# EAGLE design exp21ac (EAGLE 7.7.0)
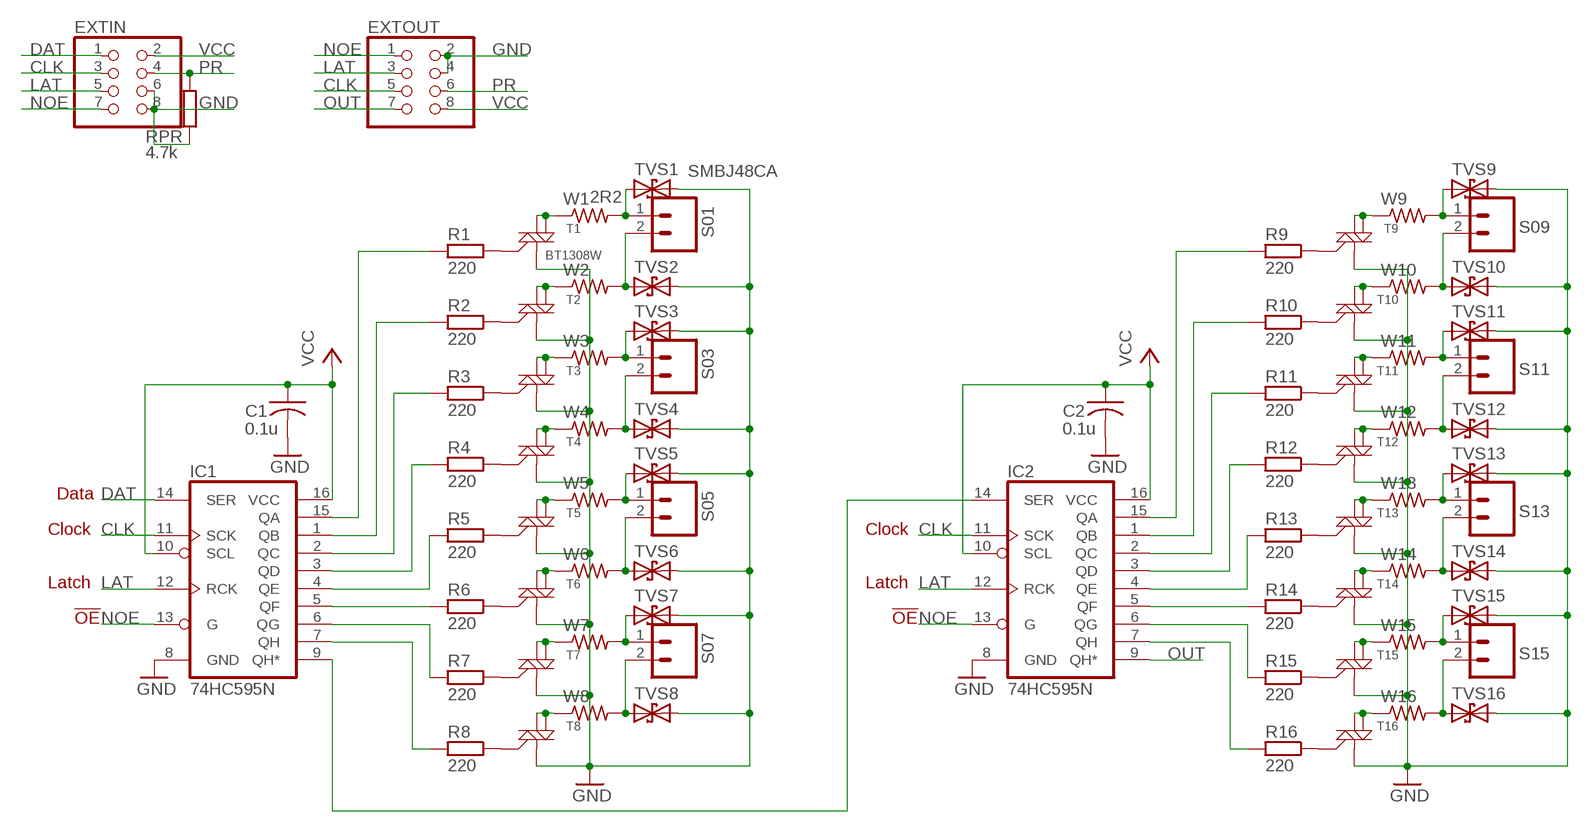
[diagram p0: schematic, sheet 1]

## Parts
C1  0.1u  C-USC0603K  [C0603K]
C2  0.1u  C-USC0603K  [C0603K]
EXTIN  PINHD-2X4/90  [2X04/90]
EXTOUT  PINHD-2X4/90  [2X04/90]
IC1  74HC595N  74LS595D  [SO16]
IC2  74HC595N  74LS595D  [SO16]
R1  220  R-EU_R0603  [R0603]
R2  220  R-EU_R0603  [R0603]
R3  220  R-EU_R0603  [R0603]
R4  220  R-EU_R0603  [R0603]
R5  220  R-EU_R0603  [R0603]
R6  220  R-EU_R0603  [R0603]
R7  220  R-EU_R0603  [R0603]
R8  220  R-EU_R0603  [R0603]
R9  220  R-EU_R0603  [R0603]
R10  220  R-EU_R0603  [R0603]
R11  220  R-EU_R0603  [R0603]
R12  220  R-EU_R0603  [R0603]
R13  220  R-EU_R0603  [R0603]
R14  220  R-EU_R0603  [R0603]
R15  220  R-EU_R0603  [R0603]
R16  220  R-EU_R0603  [R0603]
RPR  4.7k  R-EU_R0603  [R0603]
S01  M025MM-X  [SCREWTERMINAL-5MM-2-X]
S03  M025MM-X  [SCREWTERMINAL-5MM-2-X]
S05  M025MM-X  [SCREWTERMINAL-5MM-2-X]
S07  M025MM-X  [SCREWTERMINAL-5MM-2-X]
S09  M025MM-X  [SCREWTERMINAL-5MM-2-X]
S11  M025MM-X  [SCREWTERMINAL-5MM-2-X]
S13  M025MM-X  [SCREWTERMINAL-5MM-2-X]
S15  M025MM-X  [SCREWTERMINAL-5MM-2-X]
T1  BT1308W  MAC97SOT223  [SOT223]
T2  MAC97SOT223  [SOT223]
T3  MAC97SOT223  [SOT223]
T4  MAC97SOT223  [SOT223]
T5  MAC97SOT223  [SOT223]
T6  MAC97SOT223  [SOT223]
T7  MAC97SOT223  [SOT223]
T8  MAC97SOT223  [SOT223]
T9  MAC97  MAC97SOT223  [SOT223]
T10  MAC97  MAC97SOT223  [SOT223]
T11  MAC97  MAC97SOT223  [SOT223]
T12  MAC97  MAC97SOT223  [SOT223]
T13  MAC97  MAC97SOT223  [SOT223]
T14  MAC97  MAC97SOT223  [SOT223]
T15  MAC97  MAC97SOT223  [SOT223]
T16  MAC97  MAC97SOT223  [SOT223]
TVS1  SMBJ48CA  TVSSMB  [SMB]
TVS2  TVSSMB  [SMB]
TVS3  TVSSMB  [SMB]
TVS4  TVSSMB  [SMB]
TVS5  TVSSMB  [SMB]
TVS6  TVSSMB  [SMB]
TVS7  TVSSMB  [SMB]
TVS8  TVSSMB  [SMB]
TVS9  TVSSMB  [SMB]
TVS10  TVSSMB  [SMB]
TVS11  TVSSMB  [SMB]
TVS12  TVSSMB  [SMB]
TVS13  TVSSMB  [SMB]
TVS14  TVSSMB  [SMB]
TVS15  TVSSMB  [SMB]
TVS16  TVSSMB  [SMB]
W1  2R2  R-US_R2512  [R2512]
W2  R-US_R2512  [R2512]
W3  R-US_R2512  [R2512]
W4  R-US_R2512  [R2512]
W5  R-US_R2512  [R2512]
W6  R-US_R2512  [R2512]
W7  R-US_R2512  [R2512]
W8  R-US_R2512  [R2512]
W9  R-US_R2512  [R2512]
W10  R-US_R2512  [R2512]
W11  R-US_R2512  [R2512]
W12  R-US_R2512  [R2512]
W13  R-US_R2512  [R2512]
W14  R-US_R2512  [R2512]
W15  R-US_R2512  [R2512]
W16  R-US_R2512  [R2512]

## Nets
CLK: EXTIN.3 EXTOUT.5 IC1.11(SCK) IC2.11(SCK)
DAT: EXTIN.1 IC1.14(SER)
GND [power]: C1.2 C2.2 EXTIN.6 EXTIN.8 EXTOUT.2 EXTOUT.4 IC1.8(GND) IC2.8(GND) RPR.1 T1.1(M1) T2.1(M1) T3.1(M1) T4.1(M1) T5.1(M1) T6.1(M1) T7.1(M1) T8.1(M1) T9.1(M1) T10.1(M1) T11.1(M1) T12.1(M1) T13.1(M1) T14.1(M1) T15.1(M1) T16.1(M1) TVS1.C TVS2.C TVS3.C TVS4.C TVS5.C TVS6.C TVS7.C TVS8.C TVS9.C TVS10.C TVS11.C TVS12.C TVS13.C TVS14.C TVS15.C TVS16.C
LAT: EXTIN.5 EXTOUT.3 IC1.12(RCK) IC2.12(RCK)
N$1 [power]: S01.1 TVS1.A W1.2
N$2 [power]: S03.1 TVS3.A W3.2
N$3 [power]: S05.1 TVS5.A W5.2
N$4: IC1.5(QF) R6.2
N$5: IC1.6(QG) R7.2
N$6 [power]: S07.1 TVS7.A W7.2
N$7: IC1.7(QH) R8.2
N$8: R1.1 T1.3(G)
N$9: R2.1 T2.3(G)
N$10: IC1.4(QE) R5.2
N$11: IC1.3(QD) R4.2
N$12: IC1.2(QC) R3.2
N$13: IC1.1(QB) R2.2
N$14: IC1.15(QA) R1.2
N$15: R3.1 T3.3(G)
N$16: R4.1 T4.3(G)
N$17 [power]: S01.2 TVS2.A W2.2
N$18: R5.1 T5.3(G)
N$19: R6.1 T6.3(G)
N$20 [power]: S03.2 TVS4.A W4.2
N$21: R7.1 T7.3(G)
N$22: R8.1 T8.3(G)
N$23 [power]: S05.2 TVS6.A W6.2
N$24: IC2.5(QF) R14.2
N$25 [power]: S07.2 TVS8.A W8.2
N$26: IC2.6(QG) R15.2
N$27: IC2.7(QH) R16.2
N$28: IC2.4(QE) R13.2
N$29: IC2.3(QD) R12.2
N$30: IC2.2(QC) R11.2
N$31: IC2.1(QB) R10.2
N$32: IC2.15(QA) R9.2
N$33 [power]: S09.2 TVS10.A W10.2
N$34 [power]: S11.2 TVS12.A W12.2
N$35 [power]: S13.2 TVS14.A W14.2
N$36 [power]: S15.2 TVS16.A W16.2
N$37 [power]: S09.1 TVS9.A W9.2
N$38: S11.1 TVS11.A W11.2
N$39: S13.1 TVS13.A W13.2
N$40: S15.1 TVS15.A W15.2
N$41: R9.1 T9.3(G)
N$42: R10.1 T10.3(G)
N$43: R11.1 T11.3(G)
N$44: R12.1 T12.3(G)
N$45: R13.1 T13.3(G)
N$46: R14.1 T14.3(G)
N$47: R15.1 T15.3(G)
N$48: R16.1 T16.3(G)
N$49: IC1.9(QH*) IC2.14(SER)
N$50 [power]: T1.2(M2) T1.4(M2-4) W1.1
N$51 [power]: T2.2(M2) T2.4(M2-4) W2.1
N$52 [power]: T3.2(M2) T3.4(M2-4) W3.1
N$53 [power]: T4.2(M2) T4.4(M2-4) W4.1
N$54 [power]: T5.2(M2) T5.4(M2-4) W5.1
N$55 [power]: T6.2(M2) T6.4(M2-4) W6.1
N$56 [power]: T7.2(M2) T7.4(M2-4) W7.1
N$57 [power]: T8.2(M2) T8.4(M2-4) W8.1
N$58 [power]: T9.2(M2) T9.4(M2-4) W9.1
N$59 [power]: T10.2(M2) T10.4(M2-4) W10.1
N$60: T11.2(M2) T11.4(M2-4) W11.1
N$61 [power]: T12.2(M2) T12.4(M2-4) W12.1
N$62: T13.2(M2) T13.4(M2-4) W13.1
N$63 [power]: T14.2(M2) T14.4(M2-4) W14.1
N$64: T15.2(M2) T15.4(M2-4) W15.1
N$65 [power]: T16.2(M2) T16.4(M2-4) W16.1
NOE: EXTIN.7 EXTOUT.1 IC1.13(G) IC2.13(G)
OUT: EXTOUT.7 IC2.9(QH*)
PR: EXTIN.4 EXTOUT.6 RPR.2
VCC: C1.1 C2.1 EXTIN.2 EXTOUT.8 IC1.10(SCL) IC1.16(VCC) IC2.10(SCL) IC2.16(VCC)

## Notes on the sheet
- Data
- Clock | Clock
- Latch | Latch
- !OE | !OE

## Library data of the parts
C1 C2 = adafruit2013:C-US: CAPACITOR, American symbol
EXTIN EXTOUT = pinhead:PINHD-2X4: PIN HEADER
IC1 IC2 = SparkFun:74*595: 8-bit SHIFT REGISTER, output latch
R1-R16 RPR = rcl:R-EU_: RESISTOR, European symbol
S01 S03 S05 S07 S09 S11 S13 S15 = SparkFun:M02: Header 2 Standard 2-pin 0.1" header. Use with straight break away headers (SKU : PRT-00116), right angle break away headers (PRT-00553), swiss pins (PRT-00743), machine pins (PRT-00117), and female headers (PRT-00115). Molex polarized connector foot print use with SKU : PRT-08233 with associated crimp pins and housings.
T1-T16 = SparkFun:MAC97: MAC97 Triac http://www.onsemi.com/pub_link/Collateral/MAC97-D.PDF
TVS1-TVS16 = SparkFunNew:TVS
W1-W16 = resistor:R-US_: RESISTOR, American symbol

## Net classes
0 default: width 0.254 mm, clearance 0.203 mm
1 power: width 0.508 mm, clearance 0.203 mm

## Board
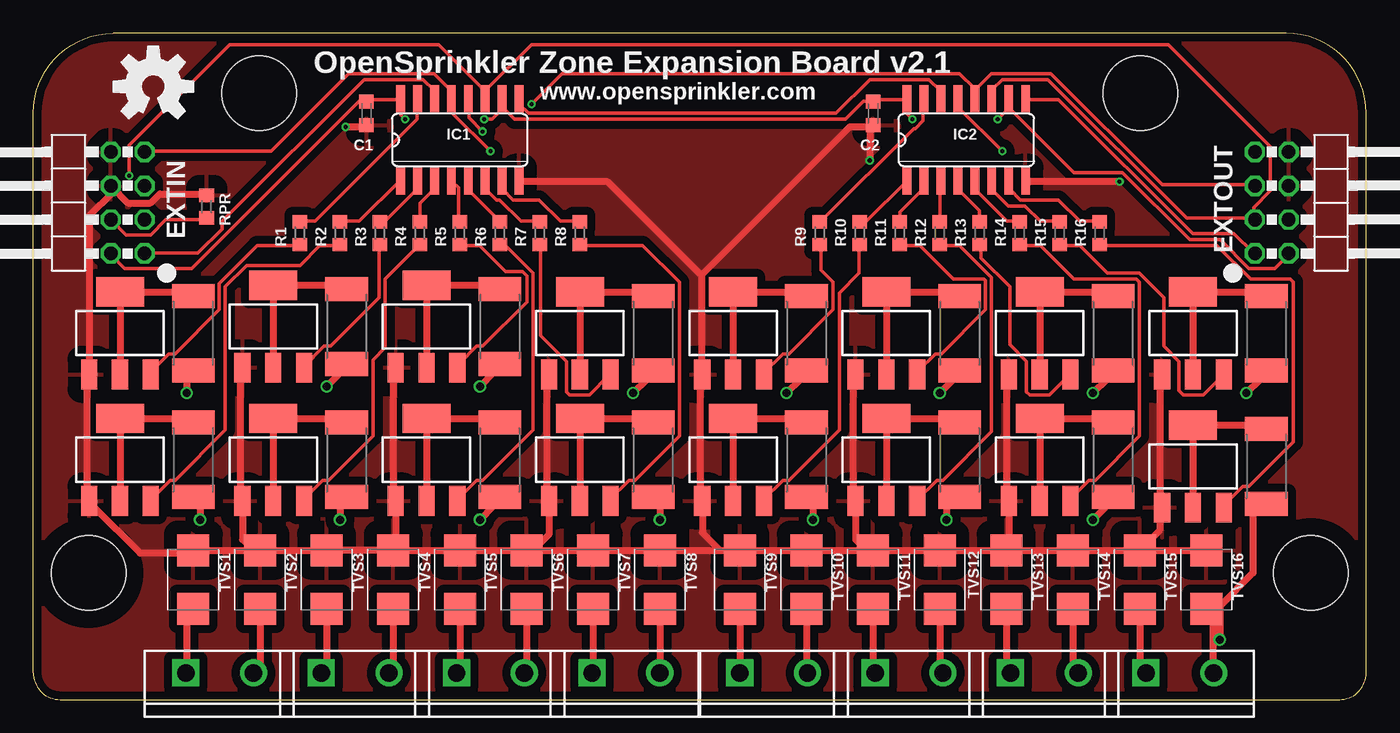
[diagram p1: board, top side]
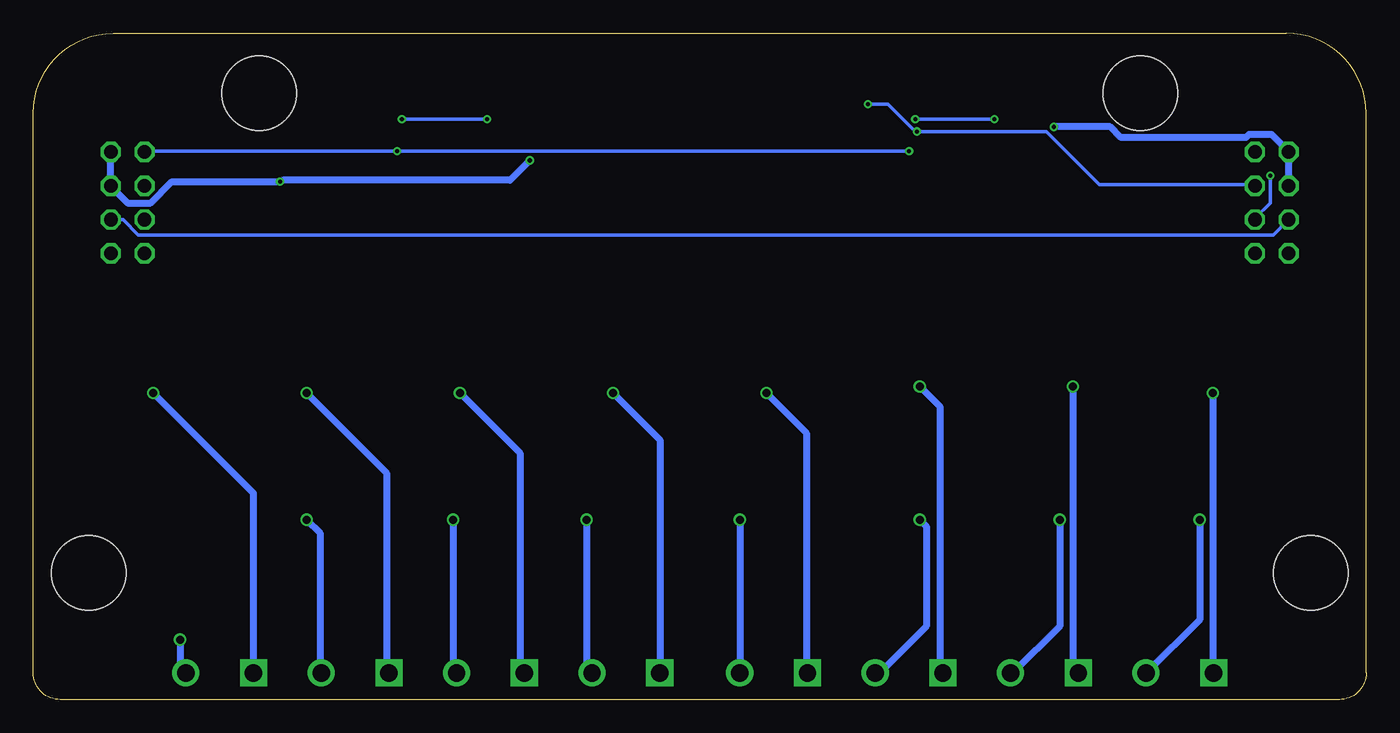
[diagram p2: board, bottom side, seen from below]

Size 100 x 50 mm. Coordinates in mm from the lower left corner, seen from the top.
Outline: 2,0 98,0 arc90 100,2 100,44 arc90 94,50 6,50 arc90 0,44 0,2 arc90 2,0
Copper layers (1*16): Top 0.035mm / dielectric 1.5mm / Bottom 0.035mm
Design rules "Fusion_eagle_rule_v1.1 *": minimum track width 6mil, minimum drill 12mil, track to track 6mil, track to pad 6mil, pad to pad 6mil, via to via 6mil, smd to smd 0mil, copper to edge 10mil, drill to drill 10mil, minimum pad ring 10mil, minimum via ring 6mil, stop-mask expansion 2mil, vias tented up to drill 100mil, thermal gap 40mil
Holes 5.6 mm at 4.14,9.49 95.86,9.49 16.95,45.49 83.06,45.49
tRestrict: area 0.6,6 to 7.6,13; area 92.4,6 to 99.4,13; area 13.4,42 to 20.4,49; area 79.6,42 to 86.6,49
vRestrict: area 21,45 to 78,49

### Footprints (pad centres in the part's own frame; a part is rotated, then mirrored left to right if it is on the bottom)
C0603K = smd 1.05 x 1.08: 1 -0.875,0; 2 0.875,0
2X04/90 = drill 1.016 octagon: 1 -3.81,-6.35; 2 -3.81,-3.81; 3 -1.27,-6.35; 4 -1.27,-3.81; 5 1.27,-6.35; 6 1.27,-3.81; 7 3.81,-6.35; 8 3.81,-3.81
SO16 = smd 0.66 x 2.032: 1 -4.445,-3.073; 2 -3.175,-3.073; 3 -1.905,-3.073; 4 -0.635,-3.073; 5 0.635,-3.073; 6 1.905,-3.073; 7 3.175,-3.073; 8 4.445,-3.073; 9 4.445,3.073; 10 3.175,3.073; 11 1.905,3.073; 12 0.635,3.073; 13 -0.635,3.073; 14 -1.905,3.073; 15 -3.175,3.073; 16 -4.445,3.073
R0603 = smd 1 x 1.1: 1 -0.85,0; 2 0.85,0
SCREWTERMINAL-5MM-2-X = drill 1.3 pad 2.032 square: 1 0,0 | drill 1.3 pad 2.032: 2 5.08,0
SOT223 = smd 1.219 x 2.235: 1 -2.311,-3.099; 2 0,-3.099; 3 2.311,-3.099 | smd 3.6 x 2.2: 4 0,3.099
SMB = smd 2.4 x 2.4: A 2.2,0; C -2.2,0
R2512 = smd 1.8 x 3.2: 1 -2.8,0; 2 2.8,0

### Placement (x,y rotation side)
C1  25,44 270 top
C2  63,44 270 top
EXTIN  2,37.29 90 top
EXTOUT  98,37.29 270 top
IC1  32,42 0 top
IC2  70,42 0 top
R1  20,35 90 top
R2  23,35 90 top
R3  26,35 90 top
R4  29,35 90 top
R5  32,35 90 top
R6  35,35 90 top
R7  38,35 90 top
R8  41,35 90 top
R9  59,35 90 top
R10  62,35 90 top
R11  65,35 90 top
R12  68,35 90 top
R13  71,35 90 top
R14  74,35 90 top
R15  77,35 90 top
R16  80,35 90 top
RPR  13,37 270 top
S01  11.44,2 0 top
S03  21.6,2 0 top
S05  31.76,2 0 top
S07  41.92,2 0 top
S09  53,2 0 top
S11  63.16,2 0 top
S13  73.32,2 0 top
S15  83.48,2 0 top
T1  6.5,27.5 0 top
T2  6.5,18 0 top
T3  18,28 0 top
T4  18,18 0 top
T5  29.5,28 0 top
T6  29.5,18 0 top
T7  41,27.5 0 top
T8  41,18 0 top
T9  52.5,27.5 0 top
T10  52.5,18 0 top
T11  64,27.5 0 top
T12  64,18 0 top
T13  75.5,27.5 0 top
T14  75.5,18 0 top
T15  87,27.5 0 top
T16  87,17.5 0 top
TVS1  12,9 270 top
TVS2  17,9 270 top
TVS3  22,9 270 top
TVS4  27,9 270 top
TVS5  32,9 270 top
TVS6  37,9 270 top
TVS7  42,9 270 top
TVS8  47,9 270 top
TVS9  53,9 270 top
TVS10  58,9 270 top
TVS11  63,9 270 top
TVS12  68,9 270 top
TVS13  73,9 270 top
TVS14  78,9 270 top
TVS15  83,9 270 top
TVS16  88,9 270 top
W1  12,27.5 270 top
W2  12,18 270 top
W3  23.5,28 270 top
W4  23.5,18 270 top
W5  35,28 270 top
W6  35,18 270 top
W7  46.5,27.5 270 top
W8  46.5,18 270 top
W9  58,27.5 270 top
W10  58,18 270 top
W11  69.5,27.5 270 top
W12  69.5,18 270 top
W13  81,27.5 270 top
W14  81,18 270 top
W15  92.5,27.5 270 top
W16  92.5,17.5 270 top

### Tracks (layer width: path | path; a pad name or v marks a point on that pad's centre or on a via)
CLK  (via drill 0.3)
  Top 0.254: IC2.11 72.01,45.15 72.01,45.83 72.69,46.52 76.12,46.52 86.53,36.12 91.55,36.12 EXTOUT.5 91.55,36.23 91.55,36.92 92.81,38.18 92.81,41.49 85.15,49.15 37.38,49.15 33.95,45.72 IC1.11 33.83,45.15 33.83,45.72 30.4,49.15 14.74,49.15 7.2,41.6 v7.2,39.32
  Bottom 0.254: v7.2,39.32 7.2,37.26 8.34,36.12 EXTIN.3
DAT
  Top 0.254: IC1.14 30.06,45.15 30.06,45.72 29.26,46.52 24.8,46.52 14.17,35.89 14.17,35.32 12.34,33.49 8.46,33.49 EXTIN.1
GND  (via drill 0.3)
  Top 0.508: 16.5,11.2 TVS1.C 12,11 8,11 4.5,14.5 T2.1 4,15 4,24 T1.1 4.23,24.57 4.23,36.35 5.94,38.06 EXTIN.6 5.83,38.52 7.09,37.26 8.8,37.26 9.49,37.95 12.92,37.95 RPR.1 | 16.5,11.2 TVS2.C TVS3.C TVS4.C | TVS4.C TVS5.C TVS6.C 37.5,11.2 | 37.5,11.2 TVS7.C TVS8.C 51.5,11.2 | 51.5,11.2 TVS9.C TVS10.C 62.5,11.2 | 62.5,11.2 TVS11.C TVS12.C TVS13.C | TVS13.C TVS14.C TVS15.C | TVS15.C TVS16.C | T3.1 15.5,24.5 15.5,15 T4.1 15.69,12.01 16.5,11.2 | T5.1 27,24.5 27,15 T6.1 27.19,11.39 TVS4.C | T7.1 38.5,24 38.5,15 T8.1 38.69,12.39 37.5,11.2 | T11.1 61.5,24 61.5,15 T12.1 61.69,12.01 62.5,11.2 | T13.1 73,24 73,15 T14.1 73.19,11.39 TVS13.C | 84.5,14.5 84.5,24 T15.1 | 84.5,14.5 T16.1 | 51.5,11.2 50.19,12.51 T10.1 50,15 50,24 T9.1 50.18,24.57 50.18,31.89 | 84.5,14.5 84.5,12.7 TVS15.C | 74.52,38.98 IC2.8 74.75,38.86 v81.5,38.86 | v23.43,42.98 24.92,42.98 C1.2 | 50.18,31.89 61.27,42.98 62.98,42.98 C2.2 62.75,42.75 v62.75,40.46 | IC1.8 36.46,38.86 43.09,38.86 49.95,32 50.18,31.89
  Bottom 0.508: EXTOUT.2 94.18,41.03 94.18,38.75 EXTOUT.4 94.18,38.52 92.93,37.26 91.21,37.26 89.61,38.86 v81.5,38.86 81.27,38.98 64.24,38.98 v62.75,40.46 | v23.43,42.98 19.2,42.98 18.4,42.18 9.03,42.18 8.8,42.41 7.09,42.41 5.83,41.15 EXTIN.8 5.83,40.92 5.83,38.63 EXTIN.6
  pour Top (isolate 0.61): 0,50 100,50 100,0 0,0
LAT  (via drill 0.3)
  Top 0.254: EXTOUT.3 91.55,38.63 84.7,38.63 76.35,46.98 71.89,46.98 70.64,45.72 70.64,45.15 IC2.12 70.64,45.83 69.49,46.98 39.66,46.98 v37.38,44.69 | v33.72,42.63 32.69,43.66 32.69,45.03 IC1.12
  Bottom 0.254: EXTIN.5 8.46,38.63 20,38.63 24,42.63 v33.72,42.63 33.83,42.63 35.89,44.69 v37.38,44.69
N$1  (via drill 0.6)
  Top 0.508: S01.1 11.5,2 11.5,6 12,6.5 TVS1.A | v11.5,23 11.5,24.5 12,25 W1.2
  Bottom 0.508: v11.5,23 11.5,2 S01.1
N$2  (via drill 0.6)
  Top 0.508: TVS3.A 22,2 S03.1 | v22,23.5 23,24.5 23,25 23.5,25.5 W3.2
  Bottom 0.508: v22,23.5 22,2 S03.1
N$3  (via drill 0.6)
  Top 0.508: TVS5.A 32,2 S05.1 | v33.5,23.5 34.5,24.5 34.5,25 35,25.5 W5.2
  Bottom 0.508: v33.5,23.5 32,22 32,2 S05.1
N$4
  Top 0.254: R6.2 34.98,35.89 32.69,38.18 32.69,38.86 IC1.5
N$5
  Top 0.254: R7.2 37.95,35.89 36.58,35.89 34.98,37.49 34.75,37.49 33.95,38.29 33.95,38.86 IC1.6
N$6  (via drill 0.6)
  Top 0.508: TVS7.A 42,2 S07.1 | v45,23 46,24 46,24.5 46.5,25 W7.2
  Bottom 0.508: v45,23 42,20 42,2 S07.1
N$7
  Top 0.254: R8.2 40.92,35.89 39.55,35.89 37.95,37.49 36.01,37.49 35.2,38.29 35.2,38.86 IC1.7
N$8
  Top 0.254: R1.1 19.89,34.06 16.8,34.06 13.95,31.2 13.95,29.26 10.63,25.95 10.17,25.95 8.91,24.69 8.91,24.46 T1.3
N$9
  Top 0.254: R2.1 22.97,34.06 21.49,34.06 20,32.58 16,32.58 14.4,30.98 14.4,20.23 10.63,16.46 10.29,16.46 8.8,14.97 T2.3
N$10
  Top 0.254: R5.2 31.89,35.89 31.89,38.41 31.43,38.86 IC1.4
N$11
  Top 0.254: R4.2 29.03,35.89 29.03,37.26 30.06,38.29 30.06,38.86 IC1.3
N$12
  Top 0.254: R3.2 26.06,35.89 26.4,35.89 28.8,38.29 28.8,38.86 IC1.2
N$13
  Top 0.254: R2.2 23.09,35.89 24.46,35.89 27.55,38.98 IC1.1
N$14
  Top 0.254: R1.2 20,35.89 21.14,35.89 28.8,43.55 28.8,45.03 IC1.15
N$15
  Top 0.254: R3.1 25.95,34.06 25.95,30.18 22.29,26.52 21.83,26.52 20.23,24.92 T3.3
N$16
  Top 0.254: R4.1 28.92,34.06 26.4,31.55 26.4,26.4 25.49,25.49 25.49,19.77 22.17,16.46 21.72,16.46 20.23,14.97 T4.3
N$17  (via drill 0.6)
  Top 0.508: TVS2.A 17,2 S01.2 | v12.5,13.5 12.5,15 12,15.5 W2.2
  Bottom 0.508: v12.5,13.5 12.5,6 16.5,2 S01.2
N$18
  Top 0.254: R5.1 32,34.06 33.49,34.06 35.43,32.12 36.69,32.12 37.03,31.77 37.03,29.83 33.72,26.52 33.26,26.52 31.89,25.15 31.89,24.92 T5.3
N$19
  Top 0.254: R6.1 35.09,34.06 35.43,34.06 37.49,32 37.49,20.23 33.72,16.46 33.26,16.46 31.77,14.97 T6.3
N$20  (via drill 0.6)
  Top 0.508: TVS4.A 27,2 S03.2 | v23,13.5 23,15 23.5,15.5 W4.2
  Bottom 0.508: v23,13.5 23,5.5 26.5,2 S03.2
N$21
  Top 0.254: R7.1 38.06,34.06 38.06,27.32 40.01,25.38 40.01,23.09 40.23,22.86 41.72,22.86 43.2,24.35 T7.3
N$22
  Top 0.254: R8.1 41.03,34.06 45.72,34.06 48.46,31.32 48.46,19.77 45.15,16.46 44.69,16.46 43.2,14.97 T8.3
N$23  (via drill 0.6)
  Top 0.508: TVS6.A 37,2 S05.2 | v33.5,13.5 34.5,14.5 34.5,15 35,15.5 W6.2
  Bottom 0.508: v33.5,13.5 33,13 33,5.5 36.5,2 S05.2
N$24
  Top 0.254: R14.2 73.95,35.89 73.04,35.89 70.64,38.29 70.64,38.86 IC2.5
N$25  (via drill 0.6)
  Top 0.508: TVS8.A S07.2 | v47,13.5 47,15 46.5,15.5 W8.2
  Bottom 0.508: v47,13.5 S07.2
N$26
  Top 0.254: R15.2 76.92,35.89 75.55,35.89 74.41,37.03 73.15,37.03 72.01,38.18 72.01,38.86 IC2.6
N$27
  Top 0.254: R16.2 79.9,35.89 78.52,35.89 76.92,37.49 74.07,37.49 73.27,38.29 73.27,38.86 IC2.7
N$28
  Top 0.254: R13.2 70.98,35.89 70.98,36.69 69.38,38.29 69.38,38.86 IC2.4
N$29
  Top 0.254: R12.2 68.01,35.89 68.01,38.86 IC2.3
N$30
  Top 0.254: R11.2 65.04,35.89 65.04,36.58 66.75,38.29 66.75,38.86 IC2.2
N$31
  Top 0.254: R10.2 62.06,35.89 62.52,35.89 65.49,38.86 IC2.1
N$32
  Top 0.254: R9.2 59.09,35.89 66.06,42.86 66.18,42.86 66.75,43.43 66.75,45.03 IC2.15
N$33  (via drill 0.6)
  Top 0.508: TVS10.A 58,2 S09.2 | v58.5,13.5 58.5,15 58,15.5 W10.2
  Bottom 0.508: v58.5,13.5 58.5,2 S09.2
N$34  (via drill 0.6)
  Top 0.508: TVS12.A 68,2 S11.2 | v68.5,13.5 68.5,14.5 69.5,15.5 W12.2
  Bottom 0.508: v68.5,13.5 68.5,2 S11.2
N$35  (via drill 0.6)
  Top 0.508: TVS14.A 78,2 S13.2 | v79.5,13.5 80.5,14.5 80.5,15 81,15.5 W14.2
  Bottom 0.508: v79.5,13.5 78.5,12.5 78.5,2 S13.2
N$36  (via drill 0.6)
  Top 0.508: S15.2 88.5,2 88.5,6 88,6.5 TVS16.A | v89,4.5 89,7 91.5,9.5 91.5,14 92.5,15 W16.2
  Bottom 0.508: v89,4.5 89,2 S15.2
N$37  (via drill 0.6)
  Top 0.508: TVS9.A S09.1 | v56.5,23 57.5,24 57.5,24.5 58,25 W9.2
  Bottom 0.508: S09.1 53,19.5 v56.5,23
N$38  (via drill 0.6)
  Top 0.508: TVS11.A 63,2 S11.1 | v68,23 69,24 69,24.5 69.5,25 W11.2
  Bottom 0.508: v68,23 63.5,18.5 63.5,2 S11.1
N$39  (via drill 0.6)
  Top 0.508: TVS13.A 73,2 S13.1 | v79.5,23 80.5,24 80.5,24.5 81,25 W13.2
  Bottom 0.508: v79.5,23 73.5,17 73.5,2 S13.1
N$40  (via drill 0.6)
  Top 0.508: TVS15.A 83,2 S15.1 | v91,23 92,24 92,24.5 92.5,25 W15.2
  Bottom 0.508: v91,23 83.5,15.5 83.5,2 S15.1
N$41
  Top 0.254: R9.1 59.09,34.06 59.09,32.23 60.01,31.32 60.01,29.26 56.69,25.95 56.24,25.95 54.75,24.46 T9.3
N$42
  Top 0.254: R10.1 61.95,34.06 61.95,32 60.47,30.52 60.47,20.23 56.69,16.46 56.24,16.46 54.75,14.97 T10.3
N$43
  Top 0.254: R11.1 65.04,34.06 66.52,34.06 69.04,31.55 71.32,31.55 71.44,31.43 71.44,29.26 68.12,25.95 67.67,25.95 66.41,24.69 66.41,24.46 T11.3
N$44
  Top 0.254: R12.1 68.01,34.06 69.49,34.06 71.89,31.66 71.89,20.12 68.24,16.46 67.78,16.46 66.29,14.97 T12.3
N$45
  Top 0.254: R13.1 71.09,34.06 71.09,33.15 73.27,30.98 73.27,26.63 74.52,25.38 74.52,23.09 74.75,22.86 76.24,22.86 77.72,24.35 T13.3
N$46
  Top 0.254: R14.1 74.07,34.06 75.55,34.06 78.07,31.55 82.75,31.55 82.98,31.32 82.98,19.77 79.67,16.46 79.21,16.46 77.72,14.97 T14.3
N$47
  Top 0.254: R15.1 77.04,34.06 78.52,34.06 80.58,32 82.98,32 84.81,30.18 84.81,26.52 85.95,25.38 85.95,23.2 86.3,22.86 87.78,22.86 89.27,24.35 T15.3
N$48
  Top 0.254: R16.1 80.01,34.06 88.81,34.06 91.33,31.55 94.3,31.55 94.53,31.32 94.53,19.32 91.21,16 90.75,16 89.38,14.63 89.38,14.4 T16.3
N$49
  Top 0.254: IC1.9 36.46,45.03 36.46,44.69 37.15,44.01 60.24,44.01 62.75,46.52 67.21,46.52 68.01,45.72 68.01,45.15 IC2.14
N$50
  Top 0.508: W1.1 12,30.6 T1.4 T1.2
N$51
  Top 0.508: W2.1 12,21.1 T2.4 T2.2
N$52
  Top 0.508: W3.1 23.5,31.1 T3.4 T3.2
N$53
  Top 0.508: W4.1 23.5,21.1 T4.4 T4.2
N$54
  Top 0.508: W5.1 35,31.1 T5.4 T5.2
N$55
  Top 0.508: W6.1 35,21.1 T6.4 T6.2
N$56
  Top 0.508: W7.1 46.5,30.6 T7.4 T7.2
N$57
  Top 0.508: W8.1 46.5,21.1 T8.4 T8.2
N$58
  Top 0.508: W9.1 58,30.6 T9.4 T9.2
N$59
  Top 0.508: W10.1 58,21.1 T10.4 T10.2
N$60
  Top 0.508: W11.1 69.5,30.6 T11.4 T11.2
N$61
  Top 0.508: W12.1 69.5,21.1 T12.4 T12.2
N$62
  Top 0.508: W13.1 81,30.6 T13.4 T13.2
N$63
  Top 0.508: W14.1 81,21.1 T14.4 T14.2
N$64
  Top 0.508: W15.1 92.5,30.6 T15.4 T15.2
N$65
  Top 0.508: W16.1 92.5,20.6 T16.4 T16.2
NOE  (via drill 0.3)
  Top 0.254: v72.69,41.15 69.38,44.46 69.38,45.03 IC2.13 | EXTIN.7 8.46,41.15 17.83,41.15 23.66,46.98 30.06,46.98 31.32,45.72 31.32,45.15 IC1.13 31.43,45.03 31.43,44.01 v34.29,41.15
  Bottom 0.254: EXTOUT.1 91.55,41.15 v72.69,41.15 v34.29,41.15
OUT
  Top 0.254: IC2.9 74.52,45.03 76.92,45.03 86.98,34.98 90.07,34.98 91.55,33.49 EXTOUT.7
PR
  Top 0.254: RPR.2 12.92,36.01 9.94,36.01 8.8,34.86 6.97,34.86 5.83,36.01 EXTIN.4
  Bottom 0.254: EXTOUT.6 94.18,36.01 93.27,36.01 92.13,34.86 6.97,34.86 5.83,36.01 EXTIN.4
VCC  (via drill 0.3)
  Top 0.254: EXTIN.2 5.83,33.38 6.86,32.35 11.89,32.35 24.46,44.92 24.92,44.92 C1.1 25.03,45.03 27.55,45.03 IC1.16 27.55,44.92 27.55,43.89 v27.89,43.55 | IC2.16 65.49,45.03 63.09,45.03 C2.1 62.98,44.92 62.29,44.92 60.92,43.55 36.12,43.55 35.2,44.46 35.2,45.03 IC1.10 35.2,44.35 34.4,43.55 v33.83,43.55 | 65.61,45.15 IC2.16 | EXTOUT.8 94.18,33.38 93.15,32.35 91.21,32.35 89.04,34.52 86.75,34.52 81.72,39.55 78.07,39.55 73.27,44.35 73.27,45.03 IC2.10 73.15,44.35 v72.35,43.55 | v65.95,43.55 65.49,44.01 65.49,44.92 IC2.16
  Bottom 0.254: v72.35,43.55 v65.95,43.55 | v33.83,43.55 v27.89,43.55

### Text on the board
tNames: OpenSprinkler Zone Expansion Board v2.1 | www.opensprinkler.com